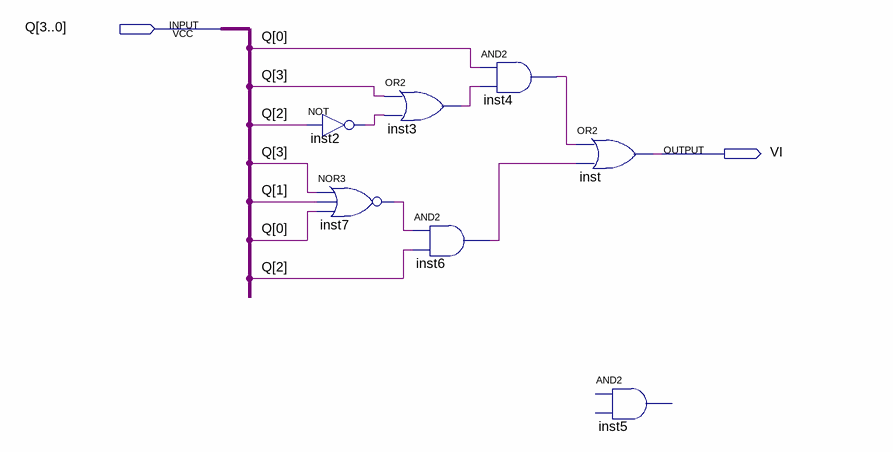
[diagram p0: schematic sheet]
// Quartus schematic VerdeIzquierda.bdf as structural Verilog: 7 symbols, 2 pins
module VerdeIzquierda (
  input  [3:0] Q,
  output VI
);

  wire inst2_out, inst3_out, inst4_out, inst6_out, inst7_out;

  not inst2 (inst2_out, Q[2]);
  nor inst7 (inst7_out, Q[3], Q[1], Q[0]);
  or inst3 (inst3_out, Q[3], inst2_out);
  and inst4 (inst4_out, Q[0], inst3_out);
  and inst6 (inst6_out, inst7_out, Q[2]);
  or inst (VI, inst4_out, inst6_out);
  // AND2 inst5 is placed but not wired
endmodule
